# EAGLE design generic_pod (EAGLE 6.6.0)
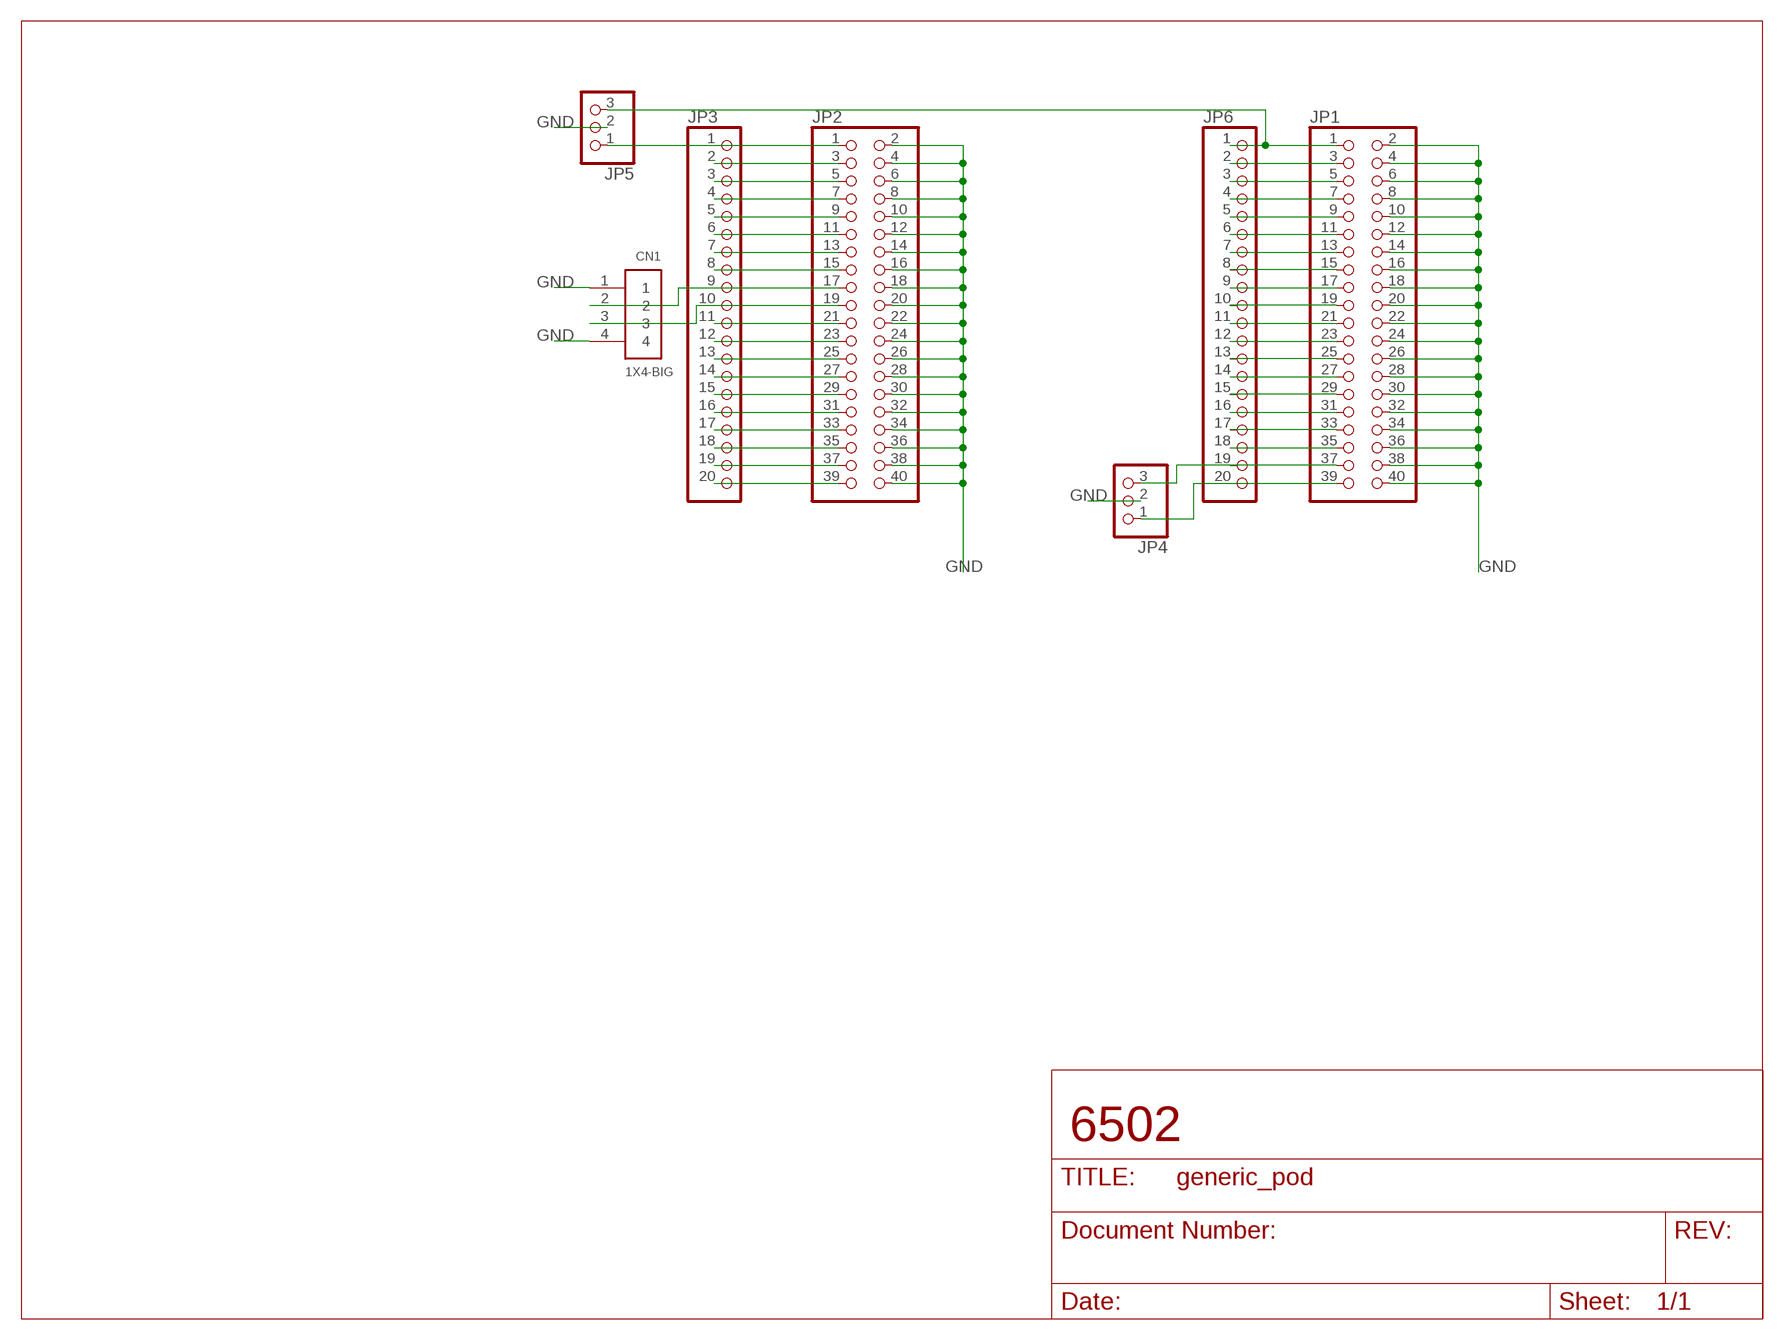
[diagram p0: schematic, sheet 1]

## Parts
CN1  1X4-BIG  [1X04-BIG]
JP1  PINHD-2X20-BIG  [2X20-BIG]
JP2  PINHD-2X20-BIG  [2X20-BIG]
JP3  PINHD-1X20-BIG  [1X20-BIG]
JP4  PINHD-1X3  [1X03]
JP5  PINHD-1X3  [1X03]
JP6  PINHD-1X20-BIG  [1X20-BIG]

## Nets
GND: CN1.1 CN1.4 JP1.2 JP1.4 JP1.6 JP1.8 JP1.10 JP1.12 JP1.14 JP1.16 JP1.18 JP1.20 JP1.22 JP1.24 JP1.26 JP1.28 JP1.30 JP1.32 JP1.34 JP1.36 JP1.38 JP1.40 JP2.2 JP2.4 JP2.6 JP2.8 JP2.10 JP2.12 JP2.14 JP2.16 JP2.18 JP2.20 JP2.22 JP2.24 JP2.26 JP2.28 JP2.30 JP2.32 JP2.34 JP2.36 JP2.38 JP2.40 JP4.2 JP5.2
N$1: JP2.1 JP3.1 JP5.1
N$2: JP2.3 JP3.2
N$3: JP2.5 JP3.3
N$4: JP2.7 JP3.4
N$5: JP2.9 JP3.5
N$6: JP2.11 JP3.6
N$7: JP2.13 JP3.7
N$8: JP2.15 JP3.8
N$9: CN1.2 JP2.17 JP3.9
N$10: CN1.3 JP2.19 JP3.10
N$11: JP2.21 JP3.11
N$12: JP2.23 JP3.12
N$13: JP2.25 JP3.13
N$14: JP2.27 JP3.14
N$15: JP2.29 JP3.15
N$16: JP2.31 JP3.16
N$17: JP2.33 JP3.17
N$18: JP2.35 JP3.18
N$19: JP2.37 JP3.19
N$20: JP2.39 JP3.20
N$21: JP1.1 JP5.3 JP6.1
N$22: JP1.3 JP6.2
N$23: JP1.5 JP6.3
N$24: JP1.7 JP6.4
N$25: JP1.9 JP6.5
N$26: JP1.11 JP6.6
N$27: JP1.13 JP6.7
N$28: JP1.15 JP6.8
N$29: JP1.17 JP6.9
N$30: JP1.19 JP6.10
N$31: JP1.21 JP6.11
N$32: JP1.23 JP6.12
N$33: JP1.25 JP6.13
N$34: JP1.27 JP6.14
N$35: JP1.29 JP6.15
N$36: JP1.31 JP6.16
N$37: JP1.33 JP6.17
N$38: JP1.35 JP6.18
N$39: JP1.37 JP4.3 JP6.19
N$40: JP1.39 JP4.1 JP6.20

## Notes on the sheet
- 6502

## Library data of the parts
CN1 = adafruit:1X4: 4-pin connector
JP1 JP2 = adafruit:PINHD-2X20: PIN HEADER
JP3 JP6 = adafruit:PINHD-1X20: PIN HEADER
JP4 JP5 = adafruit:PINHD-1X3: PIN HEADER

## Board
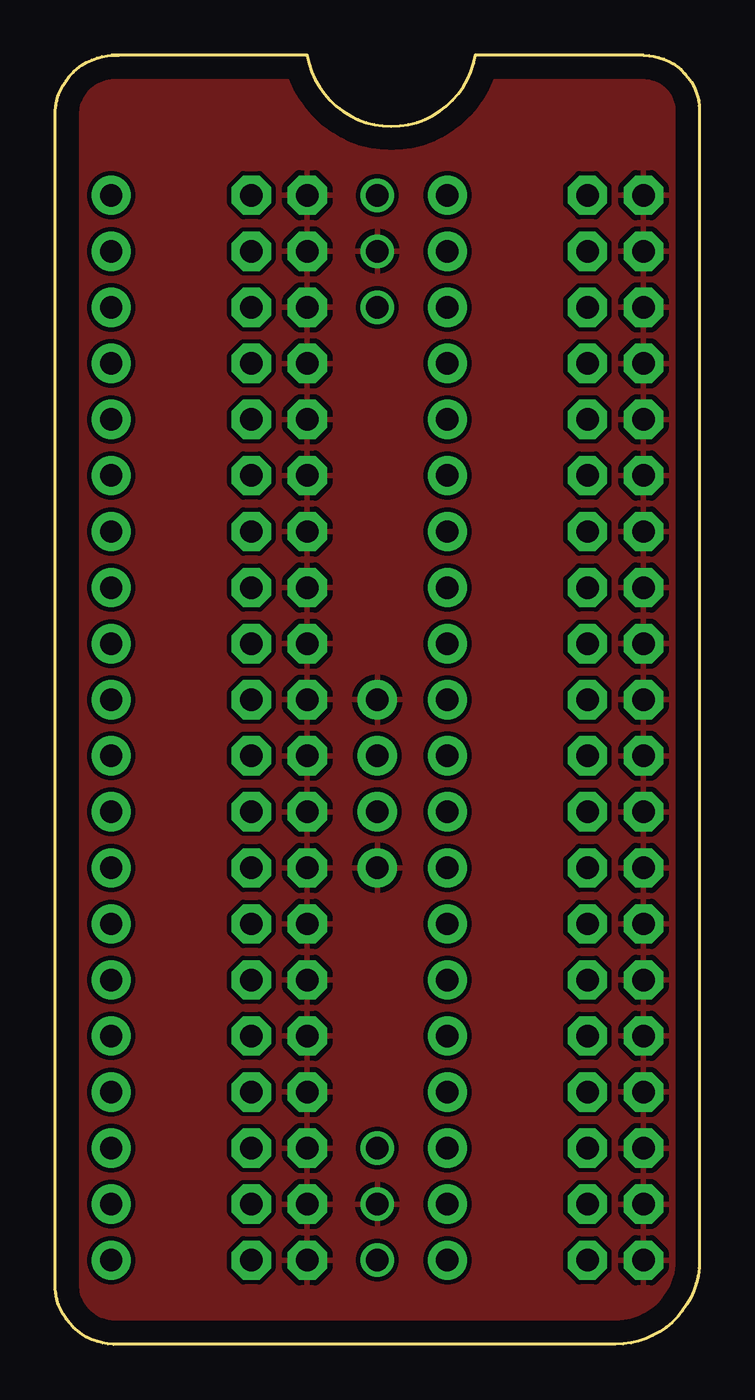
[diagram p1: board, top side]
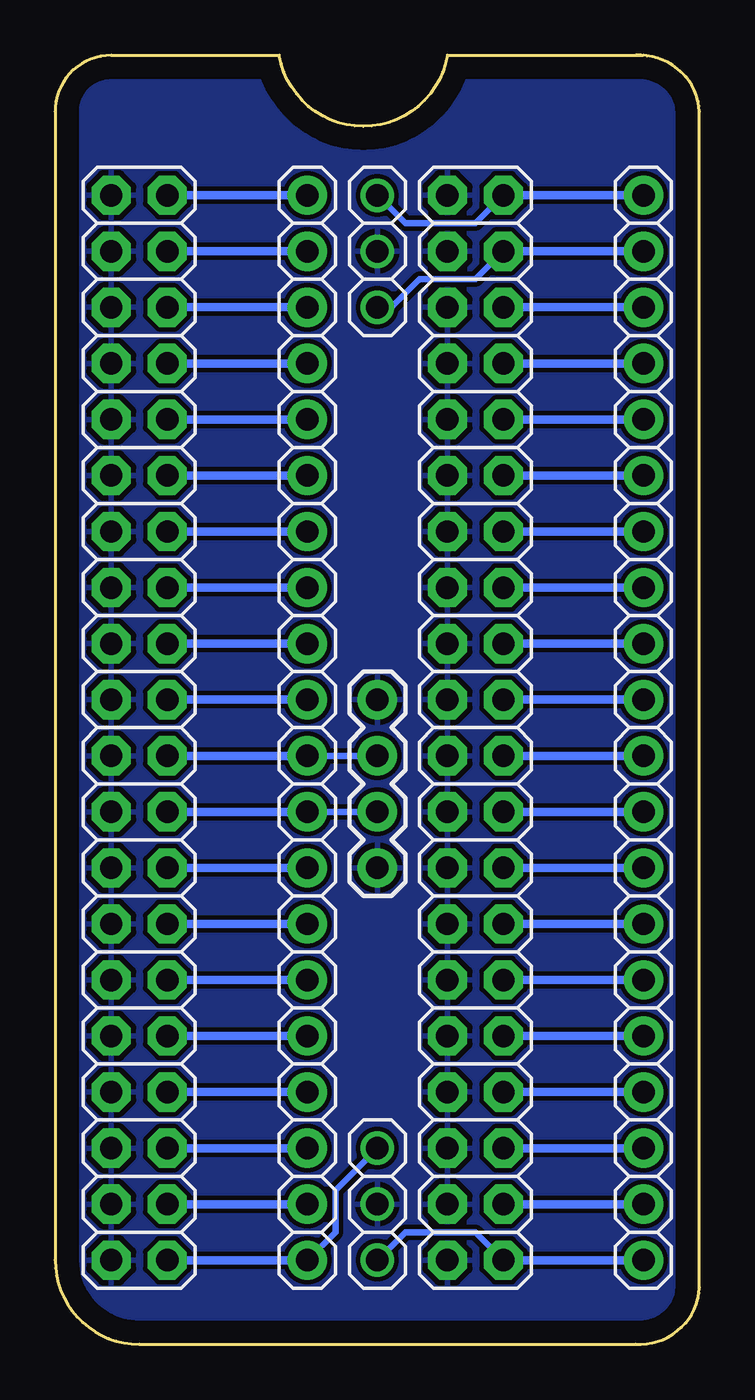
[diagram p2: board, bottom side, seen from below]

Size 29.21 x 58.42 mm. Coordinates in mm from the lower left corner, seen from the top.
Outline: 2.88,58.41 arc90 0,55.86 0,2.56 arc90 2.89,0 25.4,0 arc90 29.21,3.81 29.21,55.88 arc90 26.68,58.41
Outline: 26.67,58.42 19.05,58.42 arc-161 11.43,58.42 2.54,58.42
Copper layers (1*16): Top 0.035mm / dielectric 1.5mm / Bottom 0.035mm
Design rules "default": minimum track width 10mil, minimum drill 24mil, track to track 8mil, track to pad 8mil, pad to pad 8mil, via to via 8mil, smd to smd 8mil, copper to edge 40mil, drill to drill 8mil, minimum pad ring 10mil, minimum via ring 8mil, stop-mask expansion 4mil, vias tented up to drill 0mil, thermal gap 10mil

### Footprints (pad centres in the part's own frame; a part is rotated, then mirrored left to right if it is on the bottom)
1X04-BIG = drill 1.016 pad 1.778: 1 0,0; 2 2.54,0; 3 5.08,0; 4 7.62,0
2X20-BIG = drill 1.016 pad 1.778 octagon: 1 -24.13,-1.27; 2 -24.13,1.27; 3 -21.59,-1.27; 4 -21.59,1.27; 5 -19.05,-1.27; 6 -19.05,1.27; 7 -16.51,-1.27; 8 -16.51,1.27; 9 -13.97,-1.27; 10 -13.97,1.27; 11 -11.43,-1.27; 12 -11.43,1.27; 13 -8.89,-1.27; 14 -8.89,1.27; 15 -6.35,-1.27; 16 -6.35,1.27; 17 -3.81,-1.27; 18 -3.81,1.27; 19 -1.27,-1.27; 20 -1.27,1.27; 21 1.27,-1.27; 22 1.27,1.27; 23 3.81,-1.27; 24 3.81,1.27; 25 6.35,-1.27; 26 6.35,1.27; 27 8.89,-1.27; 28 8.89,1.27; 29 11.43,-1.27; 30 11.43,1.27; 31 13.97,-1.27; 32 13.97,1.27; 33 16.51,-1.27; 34 16.51,1.27; 35 19.05,-1.27; 36 19.05,1.27; 37 21.59,-1.27; 38 21.59,1.27; 39 24.13,-1.27; 40 24.13,1.27
1X20-BIG = drill 1.016 pad 1.778: 1 -24.13,0; 2 -21.59,0; 3 -19.05,0; 4 -16.51,0; 5 -13.97,0; 6 -11.43,0; 7 -8.89,0; 8 -6.35,0; 9 -3.81,0; 10 -1.27,0; 11 1.27,0; 12 3.81,0; 13 6.35,0; 14 8.89,0; 15 11.43,0; 16 13.97,0; 17 16.51,0; 18 19.05,0; 19 21.59,0; 20 24.13,0
1X03 = drill 1.016: 1 -2.54,0; 2 0,0; 3 2.54,0

### Placement (x,y rotation side)
CN1  14.61,21.59 90 bottom
JP1  10.16,27.94 90 bottom
JP2  25.4,27.94 90 bottom
JP3  17.78,27.94 90 bottom
JP4  14.61,49.53 270 bottom
JP5  14.61,6.35 270 bottom
JP6  2.54,27.94 90 bottom

### Tracks (layer width: path | path; a pad name or v marks a point on that pad's centre or on a via)
GND
  pour Top: 29.21,0 0,0 0,58.42 29.21,58.42
  pour Bottom: 29.21,0 0,0 0,58.42 29.21,58.42
N$1
  Bottom 0.305: JP3.1 16.51,5.08 16.51,6.99 JP5.1
  Bottom 0.381: JP2.1 JP3.1
N$2
  Bottom 0.381: JP2.3 JP3.2
N$3
  Bottom 0.381: JP2.5 JP3.3
N$4
  Bottom 0.381: JP2.7 JP3.4
N$5
  Bottom 0.381: JP2.9 JP3.5
N$6
  Bottom 0.381: JP2.11 JP3.6
N$7
  Bottom 0.381: JP2.13 JP3.7
N$8
  Bottom 0.381: JP2.15 JP3.8
N$9
  Bottom 0.305: JP3.9 CN1.2
  Bottom 0.381: JP2.17 JP3.9
N$10
  Bottom 0.305: JP3.10 CN1.3
  Bottom 0.381: JP2.19 JP3.10
N$11
  Bottom 0.381: JP2.21 JP3.11
N$12
  Bottom 0.381: JP2.23 JP3.12
N$13
  Bottom 0.381: JP2.25 JP3.13
N$14
  Bottom 0.381: JP2.27 JP3.14
N$15
  Bottom 0.381: JP2.29 JP3.15
N$16
  Bottom 0.381: JP3.16 JP2.31
N$17
  Bottom 0.381: JP2.33 JP3.17
N$18
  Bottom 0.381: JP2.35 JP3.18
N$19
  Bottom 0.381: JP2.37 JP3.19
N$20
  Bottom 0.381: JP2.39 JP3.20
N$21
  Bottom 0.305: JP5.3 13.34,5.08 10.16,5.08 JP1.1
  Bottom 0.381: JP6.1 JP1.1
N$22
  Bottom 0.381: JP1.3 JP6.2
N$23
  Bottom 0.381: JP1.5 JP6.3
N$24
  Bottom 0.381: JP1.7 JP6.4
N$25
  Bottom 0.381: JP1.9 JP6.5
N$26
  Bottom 0.381: JP1.11 JP6.6
N$27
  Bottom 0.381: JP1.13 JP6.7
N$28
  Bottom 0.381: JP6.8 JP1.15
N$29
  Bottom 0.381: JP1.17 JP6.9
N$30
  Bottom 0.381: JP1.19 JP6.10
N$31
  Bottom 0.381: JP1.21 JP6.11
N$32
  Bottom 0.381: JP1.23 JP6.12
N$33
  Bottom 0.381: JP1.25 JP6.13
N$34
  Bottom 0.381: JP1.27 JP6.14
N$35
  Bottom 0.381: JP1.29 JP6.15
N$36
  Bottom 0.381: JP1.31 JP6.16
N$37
  Bottom 0.381: JP1.33 JP6.17
N$38
  Bottom 0.381: JP1.35 JP6.18
N$39
  Bottom 0.305: JP4.3 13.97,46.99 12.7,48.26 10.16,48.26 JP1.37
  Bottom 0.381: JP1.37 JP6.19
N$40
  Bottom 0.305: JP4.1 13.34,50.8 10.16,50.8 JP1.39
  Bottom 0.381: JP1.39 JP6.20

### Text on the board
tDocu: A | 1 | B | 1 | 40 | 2 | 30 | 29 | www.zzzaccaria.com | 21 | In Circuit Test DIL V1.01 (LabRat) | 20 | 21 | 20
bDocu: 2020-12-09 | Layout by | LabRat | Z80 : 29 | 6800, 6501 : 1 & 21 | 6701,INS8900 : 30 | 2650 : 21 | 8085,8025,V30 : 20